# EasyEDA schematic SCH_JK-BLDC-Encoder-Calibrator-Tester4_2023-05-02.json
TITLE: JK-BLDC-VOLTAGE/ENCODER-CALIBRATOR/DRIVER; REV: 1.3; Date: 2023-02-12; Sheet: 1/1; Drawn By: JK; Company: For the joy of it
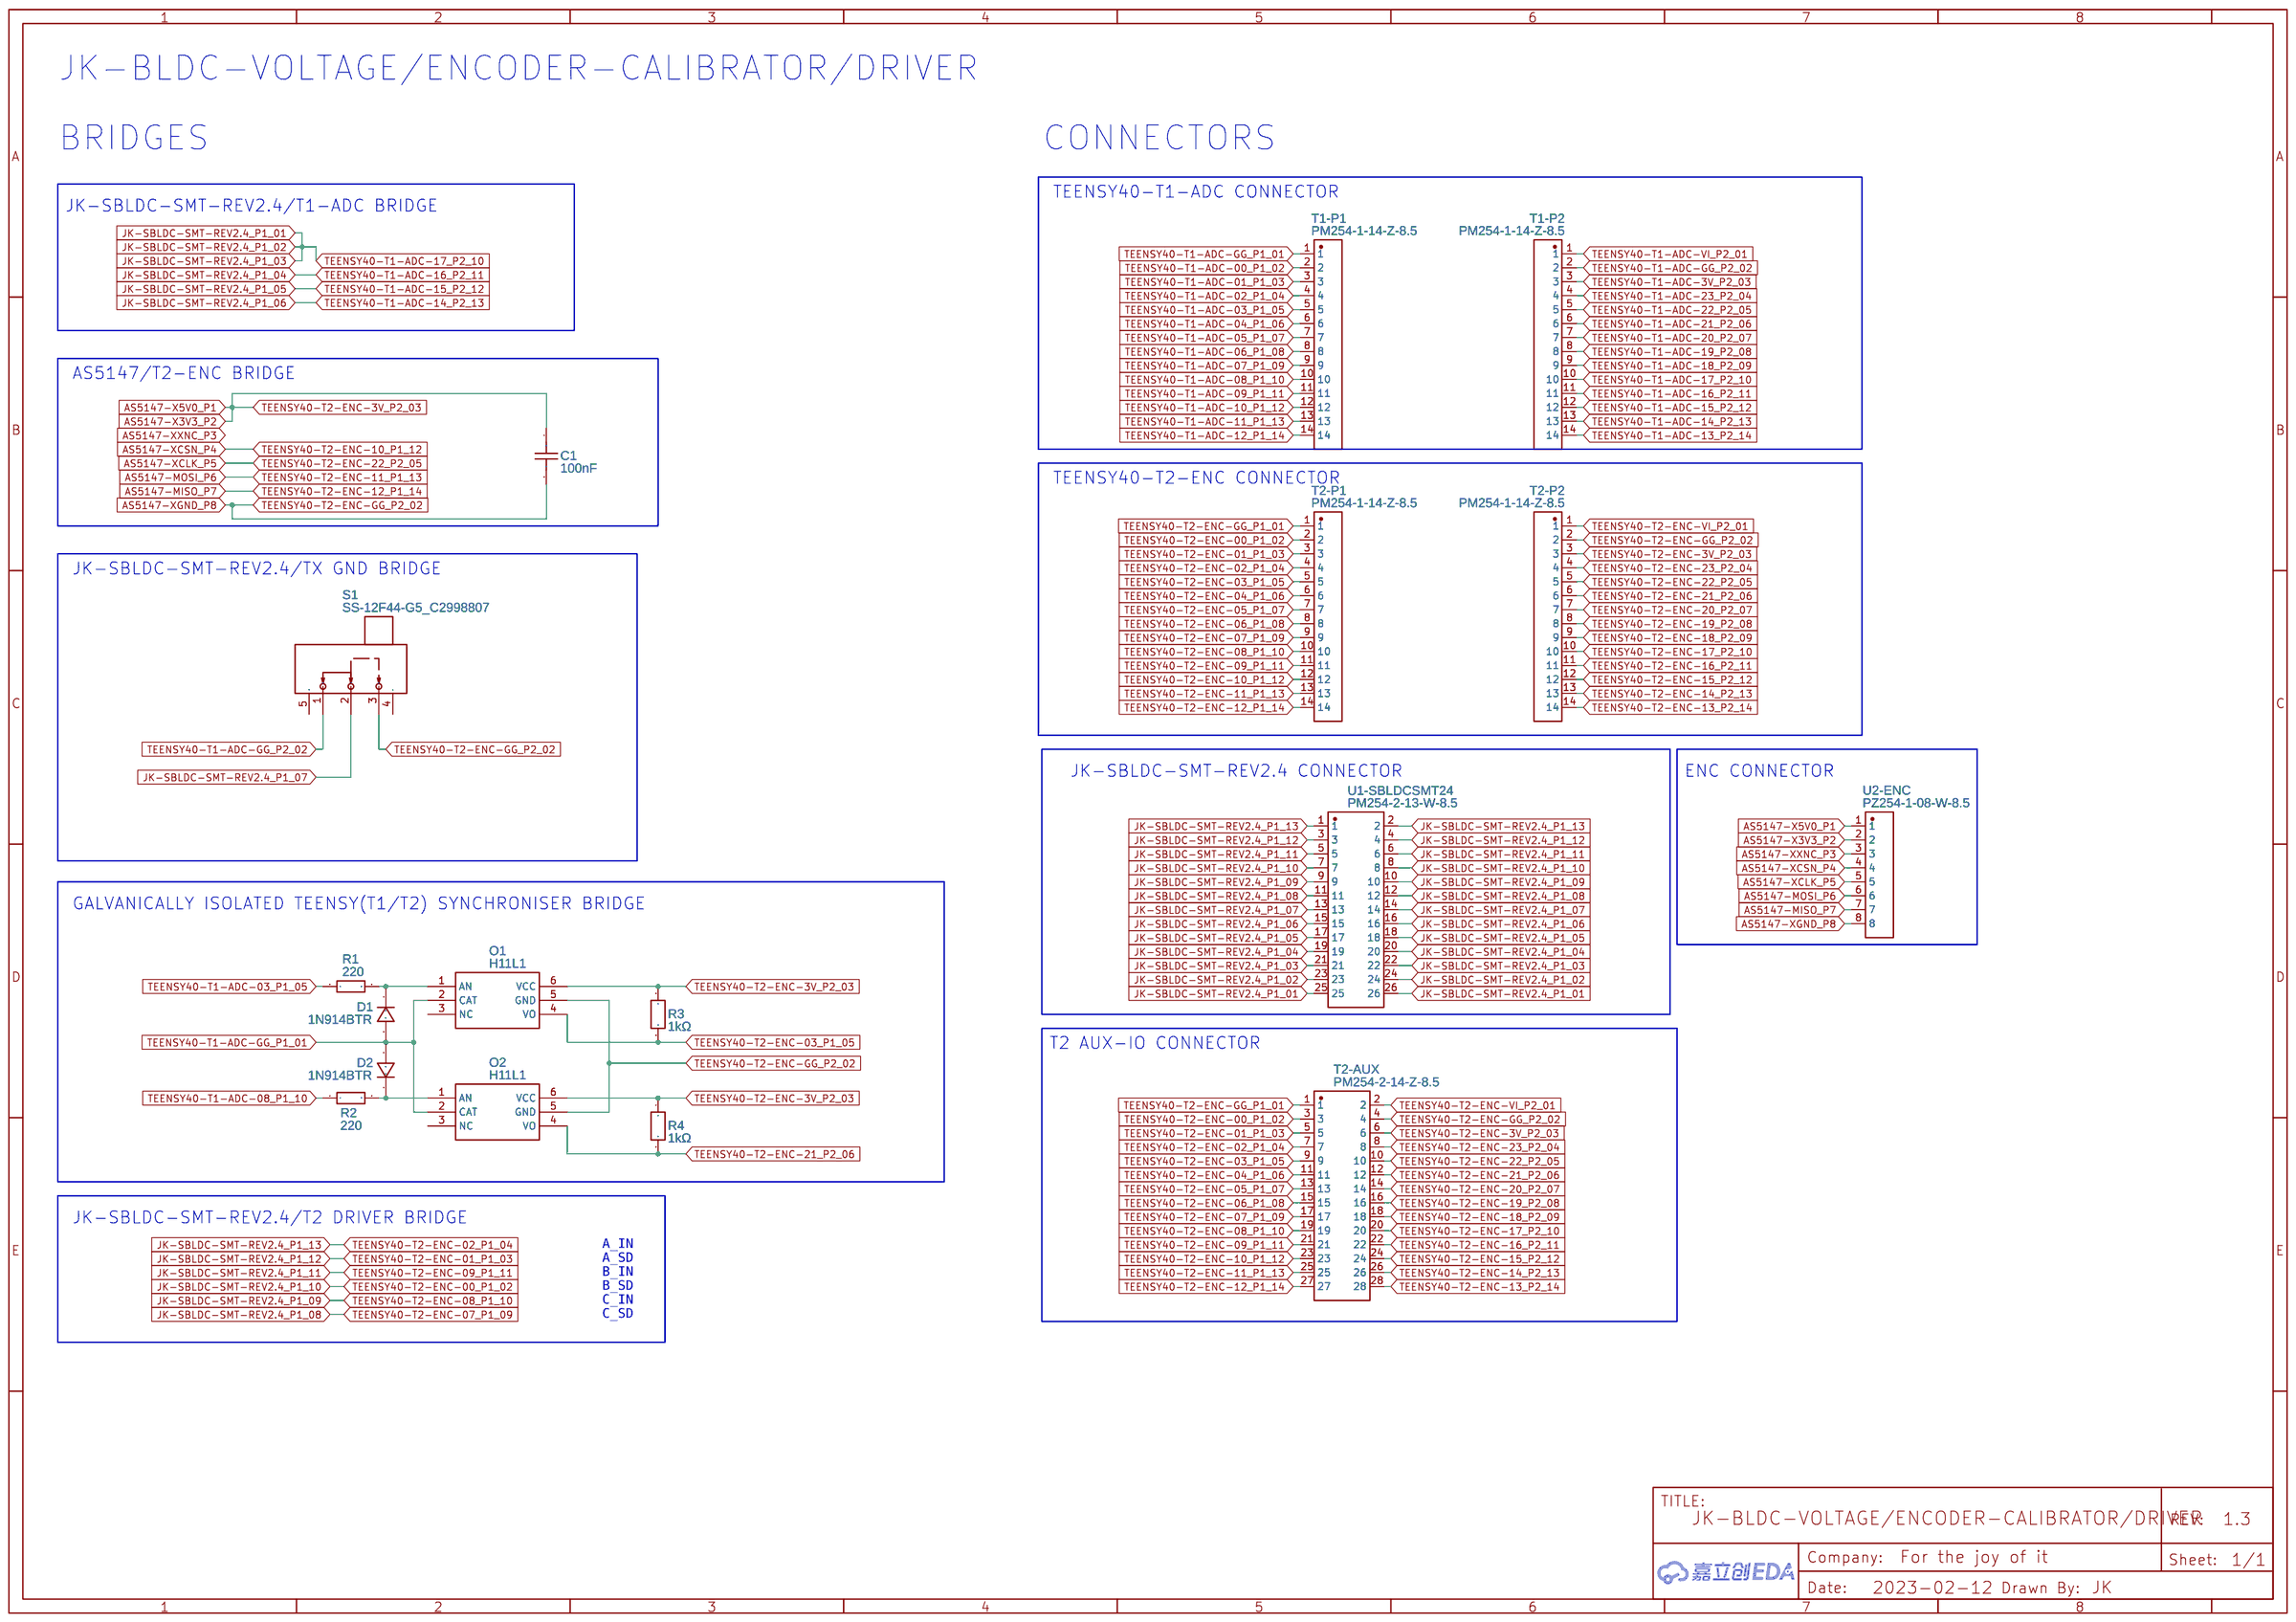
[diagram p0: schematic sheet]

## Parts
C1  100nF  [CAP-TH_L5.0-W2.5-P5.08-D0.7]
D1  1N914BTR  [DO-35_BD2.0-L4.2-P8.20-D0.5-RD]
D2  1N914BTR  [DO-35_BD2.0-L4.2-P8.20-D0.5-RD]
O1  H11L1  [DIP-6_L8.5-W6.4-P2.54-LS7.6-BL]
O2  H11L1  [DIP-6_L8.5-W6.4-P2.54-LS7.6-BL]
R1  220  [RES-TH_BD2.4-L6.3-P10.30-D0.6]
R2  220  [RES-TH_BD2.4-L6.3-P10.30-D0.6]
R3  1kΩ  [RES-TH_BD2.3-L6.5-P10.50-D0.5]
R4  1kΩ  [RES-TH_BD2.3-L6.5-P10.50-D0.5]
S1  SS-12F44-G5_C2998807  [SW-TH_SS-12F44-G5_C2998807]
T1-P1  PM254-1-14-Z-8.5  [HDR-TH_14P-P2.54-V-F-1]
T1-P2  PM254-1-14-Z-8.5  [HDR-TH_14P-P2.54-V-F-1]
T2-AUX  PM254-2-14-Z-8.5  [HDR-TH_28P-P2.54-V-F-R2-C14-S2.54-1]
T2-P1  PM254-1-14-Z-8.5  [HDR-TH_14P-P2.54-V-F-1]
T2-P2  PM254-1-14-Z-8.5  [HDR-TH_14P-P2.54-V-F-1]
U1-SBLDCSMT24  PM254-2-13-W-8.5  [HDR-TH_26P-P2.54-H-F-R2-C13-W8.5]
U2-ENC  PZ254-1-08-W-8.5  [HDR-TH_08P-P2.54-H-M-W10.4-N]

## Library data of the parts
C1 = CC2A104ZC1ID3F7C30MF: Supplier: LCSC; Supplier Part: C254109; Manufacturer: Dersonic(德尔创); Contributor: LCSC; JLCPCB Part Class: Extended Part
D1 D2 = 1N914BTR: Supplier: LCSC; Supplier Part: C258180; Manufacturer: onsemi(安森美); Contributor: LCSC; JLCPCB Part Class: Extended Part
O1 O2 = H11L1: Supplier: LCSC; Manufacturer: EVERLIGHT(亿光); Supplier Part: C78588; JLCPCB Part Class: Extended Part
R1 R2 = MFR-25FTE52-220R: Supplier: LCSC; Supplier Part: C172985; Manufacturer: YAGEO(国巨); Contributor: LCSC; JLCPCB Part Class: Extended Part; Resistance: 220Ω
R3 R4 = MF1/4W-1KΩ±1%T52: Supplier: LCSC; Supplier Part: C713997; Manufacturer: Huaxing Mechanical-Elec.; Contributor: LCSC; JLCPCB Part Class: Extended Part
S1 = SS-12F44-G5_C2998807: Supplier: LCSC; Supplier Part: C2998807; Manufacturer: DEALON(德艺隆); Manufacturer Part: SS-12F44-G5; link: https://atta.szlcsc.com/upload/public/pdf/source/20220428/590A0165C728230C4E39516860AD3726.pdf; Contributor: lcsc; JLCPCB Part Class: Extended Part
T1-P1 T1-P2 T2-P1 T2-P2 = PM254-1-14-Z-8.5: Supplier: LCSC; Supplier Part: C2897377; Manufacturer: HCTL(华灿天禄); Contributor: LCSC; JLCPCB Part Class: Extended Part
T2-AUX = PM254-2-14-Z-8.5: Supplier: LCSC; Supplier Part: C2897415; Manufacturer: HCTL(华灿天禄); Contributor: LCSC; JLCPCB Part Class: Extended Part
U1-SBLDCSMT24 = PM254-2-13-W-8.5: Supplier: LCSC; Supplier Part: C2897433; Manufacturer: HCTL(华灿天禄); Contributor: LCSC; JLCPCB Part Class: Extended Part
U2-ENC = PZ254-1-08-W-8.5: Supplier: LCSC; Supplier Part: C2894950; Manufacturer: HCTL(华灿天禄); Contributor: LCSC; JLCPCB Part Class: Extended Part

## Nets
AS5147-MISO_P7: T2-AUX.27 T2-P1.14 U2-ENC.7
AS5147-MOSI_P6: T2-AUX.25 T2-P1.13 U2-ENC.6
AS5147-X3V3_P2: C1.1 O1.6(VCC) O2.6(VCC) R3.1 R4.1 T2-AUX.6 T2-P2.3 U2-ENC.1 U2-ENC.2
AS5147-XCLK_P5: T2-AUX.10 T2-P2.5 U2-ENC.5
AS5147-XCSN_P4: T2-AUX.23 T2-P1.12 U2-ENC.4
AS5147-XGND_P8: C1.2 O1.5(GND) O2.5(GND) S1.3 T2-AUX.4 T2-P2.2 U2-ENC.8
AS5147-XXNC_P3: U2-ENC.3
JK-SBLDC-SMT-REV2.4_P1_01: T1-P2.10 U1-SBLDCSMT24.21 U1-SBLDCSMT24.22 U1-SBLDCSMT24.23 U1-SBLDCSMT24.24 U1-SBLDCSMT24.25 U1-SBLDCSMT24.26
JK-SBLDC-SMT-REV2.4_P1_04: T1-P2.11 U1-SBLDCSMT24.19 U1-SBLDCSMT24.20
JK-SBLDC-SMT-REV2.4_P1_05: T1-P2.12 U1-SBLDCSMT24.17 U1-SBLDCSMT24.18
JK-SBLDC-SMT-REV2.4_P1_06: T1-P2.13 U1-SBLDCSMT24.15 U1-SBLDCSMT24.16
JK-SBLDC-SMT-REV2.4_P1_07: S1.2 U1-SBLDCSMT24.13 U1-SBLDCSMT24.14
JK-SBLDC-SMT-REV2.4_P1_08: T2-AUX.17 T2-P1.9 U1-SBLDCSMT24.11 U1-SBLDCSMT24.12
JK-SBLDC-SMT-REV2.4_P1_09: T2-AUX.19 T2-P1.10 U1-SBLDCSMT24.9 U1-SBLDCSMT24.10
JK-SBLDC-SMT-REV2.4_P1_10: T2-AUX.3 T2-P1.2 U1-SBLDCSMT24.7 U1-SBLDCSMT24.8
JK-SBLDC-SMT-REV2.4_P1_11: T2-AUX.21 T2-P1.11 U1-SBLDCSMT24.5 U1-SBLDCSMT24.6
JK-SBLDC-SMT-REV2.4_P1_12: T2-AUX.5 T2-P1.3 U1-SBLDCSMT24.3 U1-SBLDCSMT24.4
JK-SBLDC-SMT-REV2.4_P1_13: T2-AUX.7 T2-P1.4 U1-SBLDCSMT24.1 U1-SBLDCSMT24.2
TEENSY40-T1-ADC-00_P1_02: T1-P1.2
TEENSY40-T1-ADC-01_P1_03: T1-P1.3
TEENSY40-T1-ADC-02_P1_04: T1-P1.4
TEENSY40-T1-ADC-03_P1_05: R1.1 T1-P1.5
TEENSY40-T1-ADC-3V_P2_03: T1-P2.3
TEENSY40-T1-ADC-04_P1_06: T1-P1.6
TEENSY40-T1-ADC-05_P1_07: T1-P1.7
TEENSY40-T1-ADC-06_P1_08: T1-P1.8
TEENSY40-T1-ADC-07_P1_09: T1-P1.9
TEENSY40-T1-ADC-08_P1_10: R2.1 T1-P1.10
TEENSY40-T1-ADC-09_P1_11: T1-P1.11
TEENSY40-T1-ADC-10_P1_12: T1-P1.12
TEENSY40-T1-ADC-11_P1_13: T1-P1.13
TEENSY40-T1-ADC-12_P1_14: T1-P1.14
TEENSY40-T1-ADC-13_P2_14: T1-P2.14
TEENSY40-T1-ADC-18_P2_09: T1-P2.9
TEENSY40-T1-ADC-19_P2_08: T1-P2.8
TEENSY40-T1-ADC-20_P2_07: T1-P2.7
TEENSY40-T1-ADC-21_P2_06: T1-P2.6
TEENSY40-T1-ADC-22_P2_05: T1-P2.5
TEENSY40-T1-ADC-23_P2_04: T1-P2.4
TEENSY40-T1-ADC-GG_P1_01: D1.2 D2.2 O1.2(CAT) O2.2(CAT) T1-P1.1
TEENSY40-T1-ADC-GG_P2_02: S1.1 T1-P2.2
TEENSY40-T1-ADC-VI_P2_01: T1-P2.1
TEENSY40-T2-ENC-03_P1_05: O1.4(VO) R3.2 T2-AUX.9 T2-P1.5
TEENSY40-T2-ENC-04_P1_06: T2-AUX.11 T2-P1.6
TEENSY40-T2-ENC-05_P1_07: T2-AUX.13 T2-P1.7
TEENSY40-T2-ENC-06_P1_08: T2-AUX.15 T2-P1.8
TEENSY40-T2-ENC-13_P2_14: T2-AUX.28 T2-P2.14
TEENSY40-T2-ENC-14_P2_13: T2-AUX.26 T2-P2.13
TEENSY40-T2-ENC-15_P2_12: T2-AUX.24 T2-P2.12
TEENSY40-T2-ENC-16_P2_11: T2-AUX.22 T2-P2.11
TEENSY40-T2-ENC-17_P2_10: T2-AUX.20 T2-P2.10
TEENSY40-T2-ENC-18_P2_09: T2-AUX.18 T2-P2.9
TEENSY40-T2-ENC-19_P2_08: T2-AUX.16 T2-P2.8
TEENSY40-T2-ENC-20_P2_07: T2-AUX.14 T2-P2.7
TEENSY40-T2-ENC-21_P2_06: O2.4(VO) R4.2 T2-AUX.12 T2-P2.6
TEENSY40-T2-ENC-23_P2_04: T2-AUX.8 T2-P2.4
TEENSY40-T2-ENC-GG_P1_01: T2-AUX.1 T2-P1.1
TEENSY40-T2-ENC-VI_P2_01: T2-AUX.2 T2-P2.1
Net-(D1-1): D1.1 O1.1(AN) R1.2
Net-(D2-1): D2.1 O2.1(AN) R2.2

Not connected (* = marked no-connect by the designer): O1 3(NC); O2 3(NC); S1 4 5

## Notes on the sheet
- JK-BLDC-VOLTAGE/ENCODER-CALIBRATOR/DRIVER
- BRIDGES
- CONNECTORS
- TEENSY40-T1-ADC CONNECTOR
- JK-SBLDC-SMT-REV2.4/T1-ADC BRIDGE
- AS5147/T2-ENC BRIDGE
- TEENSY40-T2-ENC CONNECTOR
- JK-SBLDC-SMT-REV2.4/TX GND BRIDGE
- JK-SBLDC-SMT-REV2.4 CONNECTOR
- ENC CONNECTOR
- GALVANICALLY ISOLATED TEENSY(T1/T2) SYNCHRONISER BRIDGE
- T2 AUX-IO CONNECTOR
- JK-SBLDC-SMT-REV2.4/T2 DRIVER BRIDGE
- A_IN
- A_SD
- B_IN
- B_SD
- C_IN
- C_SD
